# EasyEDA Pro project Main.eprj, board PCB2_1
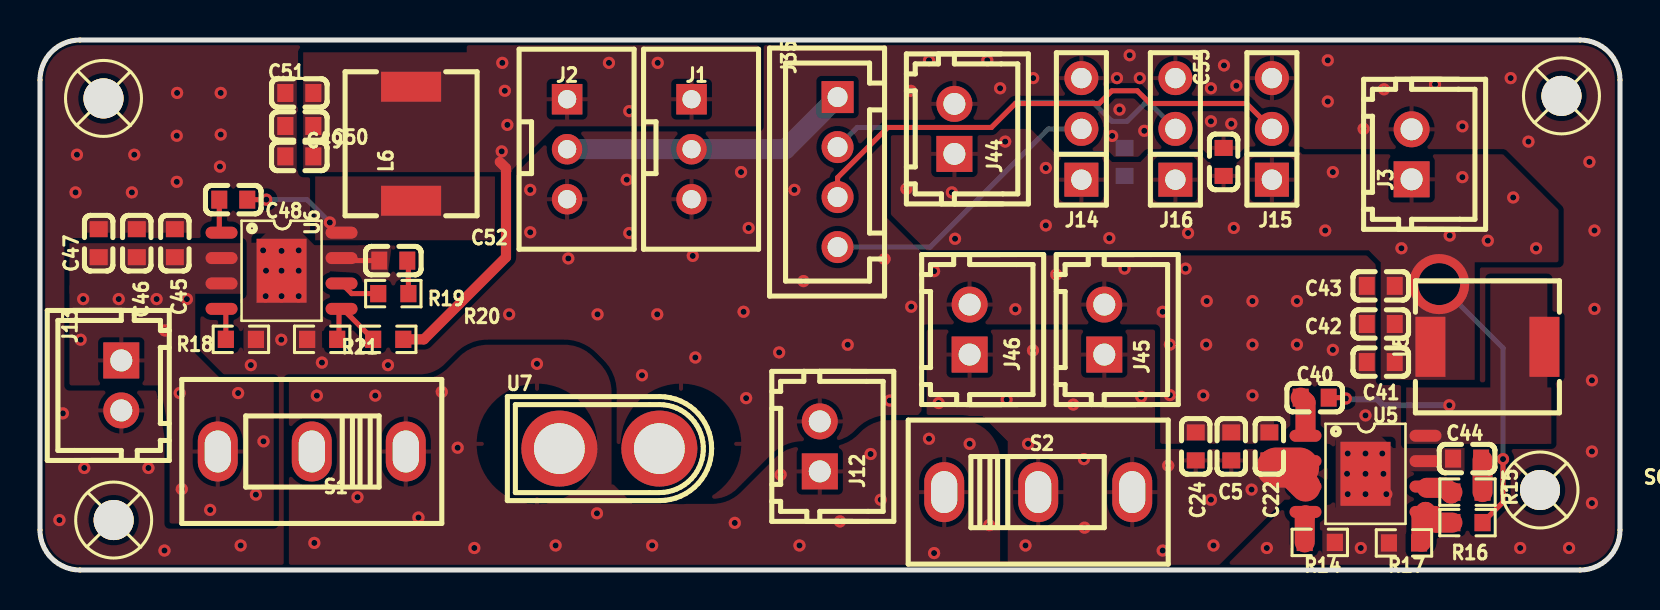
[diagram p14: board, top side]
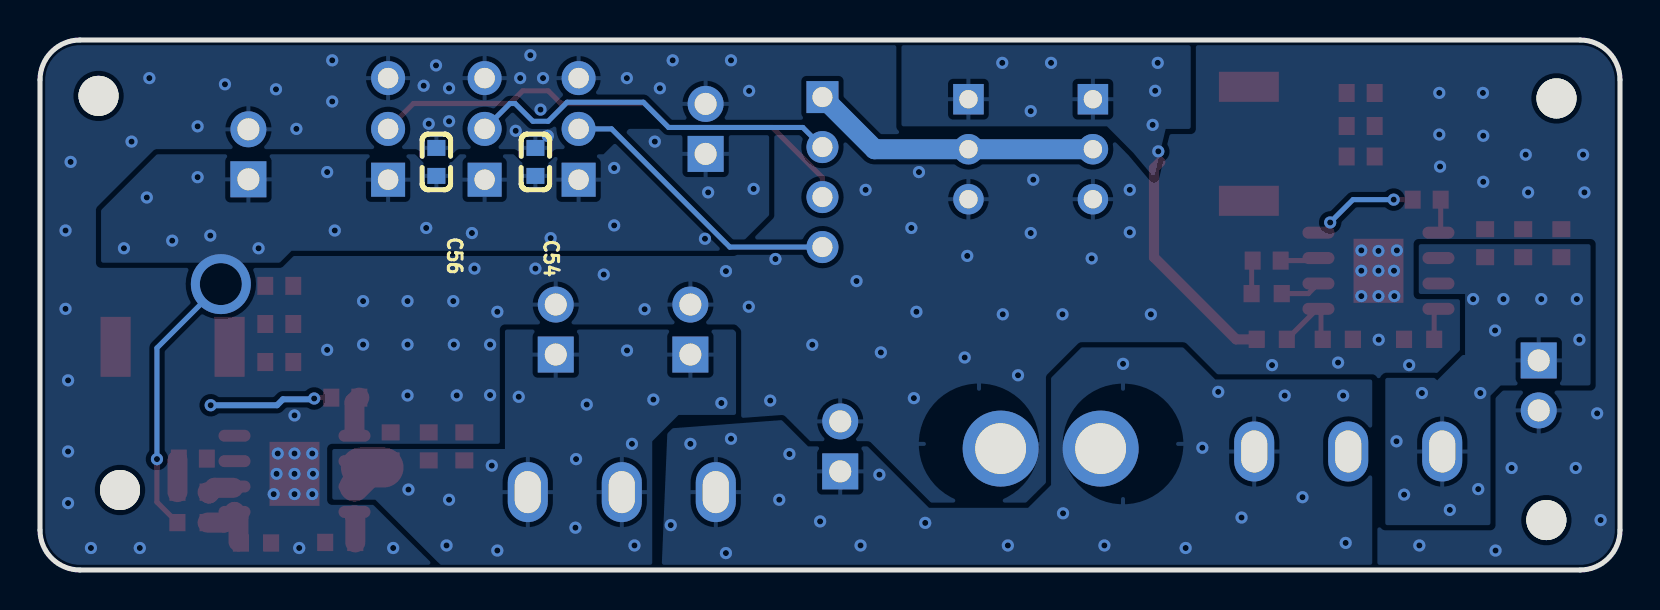
[diagram p15: board, bottom side, seen from below]

Outline 79 x 26.5 mm; copper layers: Top Layer, Bottom Layer. Coordinates in mm from the lower left corner of the outline.
Outline path: 0,24.5 0,2 arc(0.59,0.59) 2,0 77,0 arc(78.41,0.59) 79,2 79,24.5 arc(78.41,25.91) 77,26.5 2,26.5 arc(0.59,25.91) 0,24.5
Stack: Top Layer 0.035mm / Dielectric1 1.51mm FR4 er 4.5 / Bottom Layer 0.035mm

## Design rules (mm)
template: Custom Config
spacing copperThickness1oz (default): track to track 0.102, other pairs 0.152 to 0.3
spacing copperThickness2oz: track to track 0.203, other pairs 0.152 to 0.3
track width copperThickness1oz (default): min 0.127, default 0.254, max 7
track width copperThickness2oz: min 0.203, default 0.254, max 7
differential pair differentialPair (default): width min 0.127, default 0.254, max 2.54; gap min 0.152, default 0.152
via viaSize (default): diameter min 0.5, default 0.61, max 10; hole min 0.3, default 0.305, max 6.3

## Placement (name value [footprint] x y rotation side)
C5  10uF  [C0603]  59.56 6.18 90 top
C22  10uF  [C0603]  61.47 6.18 90 top
C24  100nF  [C0603]  57.78 6.18 90 top
C40  100nF  [C0603]  63.74 8.62 180 top
C41  22uF  [C0603]  67.04 10.4 180 top
C42  22uF  [C0603]  67.04 12.3 180 top
C43  22uF  [C0603]  67.04 14.21 180 top
C44  2.7nF  [C0603]  71.35 5.57 180 top
C45  10uF  [C0603]  6.74 16.34 90 top
C46  10uF  [C0603]  4.84 16.34 90 top
C47  100nF  [C0603]  2.93 16.34 90 top
C48  100nF  [C0603]  9.66 18.52 180 top
C49  22uF  [C0603]  12.97 20.68 180 top
C50  22uF  [C0603]  12.97 22.2 180 top
C51  22uF  [C0603]  12.97 23.85 180 top
C52  2.7nF  [C0603]  17.67 15.47 180 top
C54  470uF  [C0603]  54.23 20.4 90 bottom
C55  100uF  [C0603]  59.18 20.4 90 top
C56  100uF  [C0603]  59.18 20.4 90 bottom
J1  STS3032  [CONN-TH_3P-P2.50_WAFER-XH2.54-3PZZ-H62]  32.58 21.04 270 top
J2  B3B-XH-A(LF)(SN)  [CONN-TH_3P-P2.50_WAFER-XH2.54-3PZZ-H62]  26.35 21.04 270 top
J3  K230 pow  [CONN-TH_2P-P2.50_HX25003-2A]  68.58 20.78 90 top
J12  Voltage Measure  [CONN-TH_2P-P2.50_HX25003-2A]  38.99 6.18 90 top
J13  LEDPower  [CONN-TH_2P-P2.50_HX25003-2A]  4.06 9.23 270 top
J14  PZ254V-11-03P  [HDR-TH_3P-P2.54-V-M_PZ254V-11-03P]  52.07 22.06 90 top
J15  PZ254V-11-03P  [HDR-TH_3P-P2.54-V-M_PZ254V-11-03P]  61.59 22.06 90 top
J16  PZ254V-11-03P  [HDR-TH_3P-P2.54-V-M_PZ254V-11-03P]  56.77 22.06 90 top
J35  motSIG-pow  [CONN-TH_B4B-XH-A-BK-LF-SN]  39.88 19.9 270 top
J44  Teensy pow  [CONN-TH_2P-P2.50_HX25003-2A]  45.72 22.06 90 top
J45  pow0  [CONN-TH_2P-P2.50_HX25003-2A]  53.21 12.02 90 top
J46  pow1  [CONN-TH_2P-P2.50_HX25003-2A]  46.48 12.02 90 top
L5  3.3uH  [IND-SMD_CYA0650-3.3UH]  72.37 11.16 180 top
L6  3.3uH  [IND-SMD_CYA0650-3.3UH]  18.55 21.31 90 top
R14  200kΩ  [R0603]  63.99 1.38 0 top
R15  15.8kΩ  [R0603]  71.37 3.89 0 top
R16  115kΩ  [R0603]  71.37 2.37 180 top
R17  22.1kΩ  [R0603]  68.2 1.35 180 top
R18  200kΩ  [R0603]  10.05 11.53 0 top
R19  15.8kΩ  [R0603]  17.67 13.82 0 top
R20  115kΩ  [R0603]  17.41 11.53 180 top
R21  22.1kΩ  [R0603]  14.11 11.53 180 top
S1  SS-12M11G4  [SW-TH_XKB_SS-12M11XX]  13.59 5.93 180 top
S2  SS-12M11G4  [SW-TH_XKB_SS-12M11XX]  49.91 3.89 0 top
SCREW1  -  [Screw-Hole-M2]  3.17 23.58 0 top
SCREW2  -  [Screw-Hole-M2]  3.68 2.5 0 top
SCREW3  -  [Screw-Hole-M2]  76.07 23.71 0 top
SCREW4  -  [Screw-Hole-M2]  75 4 0 top
U5  AP64500SP-13  [SO-8_L4.9-W3.9-P1.27-LS6.0-BL-EP]  66.28 4.81 270 top
U6  AP64500SP-13  [SO-8_L4.9-W3.9-P1.27-LS6.0-BL-EP]  12.08 14.96 270 top
U7  XT30U-M.G.B  [CONN-TH_XT30U-M]  28.47 6.07 0 top

## Footprints (pads in the part's own frame, mm; a bottom-side part is the same pattern mirrored in y, then rotated)
C0603
  rect 0.8x0.9 smd: 1(-0.7,0) 2(0.7,0)
CONN-TH_2P-P2.50_HX25003-2A
  rect 1.8x1.8 hole 1.1: 1(-1.25,0)
  round 1.8 hole 1.1: 2(1.25,0)
CONN-TH_3P-P2.50_WAFER-XH2.54-3PZZ-H62
  rect 1.524x1.524 hole 0.914: 1(-2.5,0)
  round 1.524 hole 0.914: 2(0,0) 3(2.5,0)
CONN-TH_B4B-XH-A-BK-LF-SN
  rect 1.6x1.6 hole 1: 1(-3.75,0)
  round 1.6 hole 1: 2(-1.25,0) 3(1.25,0) 4(3.75,0)
CONN-TH_XT30U-M
  round 3.8 hole 2.54: 1(-2.5,0) 2(2.5,0)
HDR-TH_3P-P2.54-V-M_PZ254V-11-03P
  rect 1.7x1.7 hole 1.02: 1(-2.54,0)
  round 1.7 hole 1.02: 2(0,0) 3(2.54,0)
IND-SMD_CYA0650-3.3UH
  rect 1.5x3 smd: 1(-2.85,0) 2(2.85,0)
R0603
  rect 0.806x0.864 smd: 1(-0.753,0) 2(0.753,0)
Screw-Hole-M2
  round 2 hole 2: 1(0,0)
SO-8_L4.9-W3.9-P1.27-LS6.0-BL-EP
  oval 0.6x1.6 smd: 1(-1.905,-3) 2(-0.635,-3) 3(0.635,-3) 4(1.905,-3) 5(1.905,3) 6(0.635,3) 7(-0.635,3) 8(-1.905,3)
  rect 3.2x2.5 smd: 9(0,0)
SW-TH_XKB_SS-12M11XX
  oval 2x3 hole 1.3x2.1: 1(-4.7,0) 2(0,0) 3(4.7,0)

## Nets
As in the schematic.

Pads without a net: S1 2; SCREW1 1; SCREW2 1; SCREW3 1; SCREW4 1

## Via types
v1: diameter 0.61, hole 0.305, Top Layer to Bottom Layer, 189 vias
v2: diameter 3, hole 2.1, Top Layer to Bottom Layer, 1 via

## Routing (per net, layer and track width the routed paths; a pad name or vN(x,y) marks a point on that pad's centre or on a via; arc(x,y) is an arc through that point)
+5V: length 13.7
  Top Layer w0.254: v1(73.15,5.55) 73.15,3.39 R16.1
  Bottom Layer w0.254: v2(69.96,14.3) 73.15,11.1 v1(73.15,5.55)
  vias: v1(43.32,19.06) v1(45.59,18.88) v1(45.75,16.56) v1(48.26,21.42) v1(50.29,20.1) v1(50.29,17.23) v1(53.47,16.59) v1(57.4,16.85) v1(59.69,17.1) v1(64.26,16.97) v1(64.64,19.9) v1(68.07,16.09) v1(70.49,16.72) v1(71.12,19.64) v1(72.39,16.47) v1(73.66,18.63) v1(74.8,16.09)
+5VM: length 11.7
  Top Layer w0.508: 22.99,20.4 23.3,20.09 23.3,15.64 19.2,11.53 R20.1
  vias: v1(23.11,25.36) v1(23.09,20.93) v1(23.24,23.96) v1(23.37,22.26) v1(28.45,25.36) v1(29.46,22.94) v1(30.89,25.36)
+VCC: length 3
  Top Layer w1: 61.82,5.12 C22.1
  Top Layer w1.5: U5.3 62.64,4.81 62.96,5.12
  Top Layer w2: 62.96,5.12 61.82,5.12
  vias: v1(44.93,8.35) v1(48.33,8.52) v1(49.28,1.23) v1(49.4,6.31) v1(49.65,10.98) v1(51.66,8.27) v1(52.2,5.55) v1(52.23,2.12) v1(55.06,8.66) v1(56.13,0.97) v1(56.41,5.22) v1(58.55,3.51) v1(58.67,1.23) v1(60.58,4.02)
+BATT:
  vias: v1(13.72,1.35) v1(13.84,8.72) v1(15.88,3.64) v1(16.76,8.72) v1(18.92,2.62) v1(20.09,8.91) v1(20.88,6.11) v1(21.72,1.1) v1(24.85,10.31) v1(25.78,1.23) v1(27.85,2.83) v1(30.61,1.23) v1(34.74,2.36) v1(37.03,4.77) v1(37.97,1.23) v1(40,2.43) v1(41.53,5.8) v1(42.04,3.51) v1(44.45,6.56) v1(44.7,0.85) v1(46.48,6.31) v1(47.46,2.24)
+VMOT:
  vias: v1(2.03,11.51) v1(2.16,13.55) v1(3.94,13.55) v1(5.83,13.55) v1(6.25,11.98) v1(6.98,8.85) v1(7.09,4.05) v1(7.34,13.55) v1(8.51,3) v1(9.91,8.85) v1(10.8,3.77) v1(11.18,6.43)
HS45HB-0_SIGNAL_POW: length 25.3
  Top Layer w0.254: J35.3 39.88,19.62 42.38,22.13 47.57,22.13 48.77,23.33 52.96,23.33 53.59,23.96 54.86,23.96 55.5,23.33 60.32,23.33 J15.2
HS45HB-1_SIGNAL_POW: length 19.1
  Bottom Layer w0.254: J16.2 55.5,23.33 55.25,23.33 54.36,22.44 53.59,22.44 52.64,23.39 48.83,23.39 47.57,22.13 40.86,22.13 J35.2
KRS3301_SIGNAL_POW: length 14.6
  Bottom Layer w0.254: J35.4 44.51,16.15 50.42,22.06 J14.2
POWER_GND: length 1.9
  Top Layer w0.254: 15.08,15.6 15.2,15.47 C52.2
  vias: v1(0.97,2.5) v1(1.14,7.83) v1(1.85,20.77) v1(1.78,18.88) v1(2.21,5.1) v1(4.59,18.88) v1(4.71,20.77) v1(5.42,5.1) v1(6.22,0.97) v1(6.84,21.71) v1(6.84,19.41) v1(6.85,23.85) v1(9.04,23.85) v1(9.04,21.77) v1(9,20.17) v1(10.03,1.23) v1(10.54,10.24) v1(11.16,15.98) v1(11.3,14.96) v1(11.28,13.69) v1(12.08,15.95) v1(12.08,14.96) v1(12.08,13.69) v1(12.06,11.51) v1(12.93,15.98) v1(12.93,14.96) v1(12.93,13.69) v1(14.1,10.37) v1(17.4,10.24) v1(23.46,12.78) v1(24.51,19.01) v1(24.51,16.89) v1(26.42,15.58) v1(27.88,12.78) v1(29.34,19.52) v1(29.46,16.85) v1(30.1,9.74) v1(30.86,12.78) v1(32.64,15.7) v1(32.77,10.62) v1(35.05,19.9) v1(35.18,12.91) v1(35.31,8.59) v1(35.43,17.1) v1(36.96,10.88) v1(37.72,19.01) v1(38.17,14.45) v1(40.39,11.26) v1(42.23,15.55) v1(42.49,8.47) v1(43.54,23.96) v1(43.56,13.17) v1(44.45,25.48) v1(44.7,14.94) v1(47.37,25.48) v1(48.01,24.09) v1(48.77,13.04) v1(49.66,24.59) v1(50.81,14.77) v1(53.61,21.7) v1(53.85,24.59) v1(53.97,23.02) v1(54.23,15.07) v1(54.48,25.74) v1(54.99,24.59) v1(55.21,21.96) v1(56.13,12.91) v1(56.5,11.27) v1(56.5,8.75) v1(57.28,15.07) v1(58.16,8.73) v1(58.34,13.44) v1(58.31,11.27) v1(58.55,24.09) v1(58.55,22.44) v1(59.2,25.23) v1(59.56,22.31) v1(59.82,24.21) v1(60.62,13.44) v1(60.62,11.27) v1(60.62,8.73) v1(61.34,1.1) v1(62.85,13.44) v1(62.85,11.27) v1(64.39,25.48) v1(64.39,23.43) v1(64.64,11.01) v1(65.39,5.82) v1(65.35,4.81) v1(65.39,3.79) v1(66.04,1.1) v1(66.18,22.06) v1(66.28,7.73) v1(66.28,5.82) v1(66.28,4.81) v1(66.28,3.79) v1(67.11,5.82) v1(67.2,24.03) v1(67.17,4.81) v1(67.32,3.79) v1(69.75,24.28) v1(71.12,22.18) v1(73.53,24.59) v1(74.01,1.1) v1(74.42,21.42) v1(76.45,1.1) v1(77.47,20.4) v1(77.6,9.48) v1(77.6,5.93) v1(77.6,3.34) v1(77.72,16.97) v1(77.72,13.06)
STS3032_SIGNAL_POW: length 14.6
  Bottom Layer w1: J2.2 J1.2 37.27,21.04 J35.1
$1N35510: length 1.7
  Top Layer w1: C40.2 63.28,8.38 63.28,7.01
$1N35520: length 6.2
  Top Layer w0.254: v1(65.29,8.57) 65.25,8.62 C40.1
  Bottom Layer w0.3: v1(65.29,8.57) 65.33,8.53 66.85,8.53 67.15,8.24 v1(70.47,8.24)
$1N35575: length 3.1
  Top Layer w1: R16.2 69.81,2.37 U5.5 69.07,2.7 69.07,1.42
$1N35837: length 1.4
  Top Layer w1: 69.34,4.11 70.27,4.11 70.55,3.83 70.56,3.83 R15.1
$1N35914: length 1.6
  Top Layer w1: R15.2 72.13,5.5
$1N35993: length 1.4
  Top Layer w1: R14.1 63.24,2.7 63.28,2.74
$1N36774: length 1.7
  Top Layer w0.254: 9.08,16.87 8.96,16.98 C48.2
$1N36776: length 4.6
  Top Layer w0.254: C48.1 v1(11.32,18.52)
  Bottom Layer w0.254: v1(14.49,17.38) 13.35,18.52 v1(11.32,18.52)
$1N36782: length 3.9
  Top Layer w0.254: 15.12,11.53 14.99,11.53 14.95,11.57 14.95,12.93 U6.5 15.13,13.06 R20.2
$1N36795: length 2
  Top Layer w0.254: 15.08,14.33 15.59,13.82 R19.1
$1N36798: length 1.7
  Top Layer w0.254: C52.1 18.42,15.42 18.42,13.82
$1N36802: length 1.6
  Top Layer w0.254: R18.1 9.29,12.84 U6.4

## Copper pours and planes (outline as drawn; the poured copper is in the pictures)
+5V on Top Layer: 42.54,22.06 42.54,17.77 44.34,15.98 66.44,15.98 67.03,15.39 75.93,15.39 75.93,18.01 73.15,20.78 63.12,20.78 62.99,20.91 60.4,20.91 59.89,20.4 58.4,20.4 58.02,20.78 55.41,20.78 55.02,20.4 53.6,20.4 53.32,20.68 50.9,20.68 49.53,22.06
+5V on Top Layer: 67.04,15.82 71.74,15.82 71.74,9.51 67.04,9.51
+5V on Bottom Layer: 42.54,22.06 49.55,22.06 50.82,20.78 53.14,20.78 53.52,20.4 54.94,20.4 55.32,20.78 58.02,20.78 58.4,20.4 59.86,20.4 60.24,20.78 73.15,20.78 75.95,17.99 75.95,15.36 67.02,15.36 66.42,15.96 44.32,15.96 42.54,17.74
+5VM on Top Layer: 13.16,25.89 23.6,25.89 23.6,19.9 13.16,19.9
+5VM on Top Layer: 21.34,27.26 21.34,22.31 21.46,22.18 22.61,22.18 23.3,19.13 23.52,19.92 25.78,22.18 35.93,22.18 35.93,27.12 36.07,27.26
+5VM on Bottom Layer: 23.3,19.62 24.39,20.91 25.65,22.18 35.93,22.18 35.93,27.12 36.07,27.26 21.46,27.26 21.46,22.06 22.71,22.06
+VCC on Top Layer: 44.33,12.02 44.33,7.84 44.2,7.7 47.12,7.7 48.39,6.43 48.39,-0.3 58.42,-0.3 62.23,3.51 64.39,3.51 64.39,6.05 55.75,6.05 55.75,12.02
+VCC on Bottom Layer: 55.75,12.02 44.32,12.02 44.2,11.89 44.2,7.75 47.07,7.75 48.39,6.43 48.39,-0.32 58.4,-0.32 62.23,3.51 64.39,3.51 64.39,6.05 55.75,6.05
+BATT on Top Layer: 12.44,9.53 12.44,-0.46 13.03,-1.87 14.44,-2.46 46.01,-2.46 47.42,-1.87 48.01,-0.46 48.01,5.49 47.42,6.91 46.01,7.49 42.46,7.49 41.69,7.34 41.04,6.91 40.9,6.77 40.25,6.33 39.48,6.18 38.16,6.18 37.39,6.03 36.74,5.59 35.04,3.89 34.39,3.46 33.63,3.31 29.64,3.31 28.68,4.28 28.57,4.28 28.57,8.91 28.42,9.67 27.99,10.32 27.64,10.67 26.99,11.11 26.22,11.26 22.39,11.26 21.62,11.11 20.97,10.67 20.41,10.11 19.76,9.68 19,9.53 12.49,9.53 12.45,9.48 12.45,9.52
+BATT on Bottom Layer: 12.39,9.53 12.39,0.08 47.92,0.08 47.62,7.07 41.91,7.49 40.6,6.18 37.62,6.18 34.55,3.11 29.59,3.11 28.45,4.25 28.45,9.61 26.92,11.13 21.84,11.13 20.24,9.53
+VMOT on Top Layer: 1.47,14.32 1.47,9.23 6.02,9.23 6.48,6.71 6.48,2.32 11.69,2.32 11.69,9.53 9.07,9.53 7.76,10.84 7.76,14.32
+VMOT on Top Layer: 1.47,16.34 10.08,16.34 10.08,13.81 1.47,13.81
+VMOT on Bottom Layer: 1.47,16.29 1.47,9.23 5.96,9.23 6.48,8.72 6.48,2.24 11.74,2.24 11.74,9.56 11.68,9.61 9.27,9.61 9.14,9.48 7.87,10.75 7.75,10.75 7.75,13.8 10.06,13.8 10.06,16.29
POWER_GND on Top Layer: 56.1,14.91 68.28,14.91 68.28,0.49 56.1,0.49
POWER_GND on Top Layer: 67.54,6.1 71.23,6.1 71.23,4.94 67.54,4.94
POWER_GND on Top Layer: 1.16,24.92 17.59,24.92 17.59,10.64 1.16,10.64
POWER_GND on Top Layer: -5.97,31.96 85.47,31.96 85.47,-7.79 -5.97,-7.79
POWER_GND on Bottom Layer: 56.1,14.97 66.7,14.97 66.7,6.5 56.1,6.5
POWER_GND on Bottom Layer: 64.16,8.08 71.23,8.08 71.23,0.49 64.16,0.49
POWER_GND on Bottom Layer: 1.14,24.92 12.84,24.92 12.84,16.61 1.14,16.61
POWER_GND on Bottom Layer: -5.08,32.09 85.85,32.09 85.85,-7.92 -5.08,-7.92
POWER_GND on Bottom Layer: 10.01,17.46 15.98,17.46 15.98,10.77 10.01,10.77
$1N35520 on Top Layer: 68.31,9.13 75.56,9.13 75.56,6.31 68.31,6.31
$1N35520 on Top Layer: 72.52,14.56 75.37,14.56 75.37,6.33 72.52,6.33
$1N36776 on Top Layer: 13.76,19.68 22.75,19.68 22.75,16.49 13.76,16.49
